# EAGLE design triaki mniejsze_ver.5 (EAGLE 7.6.0)
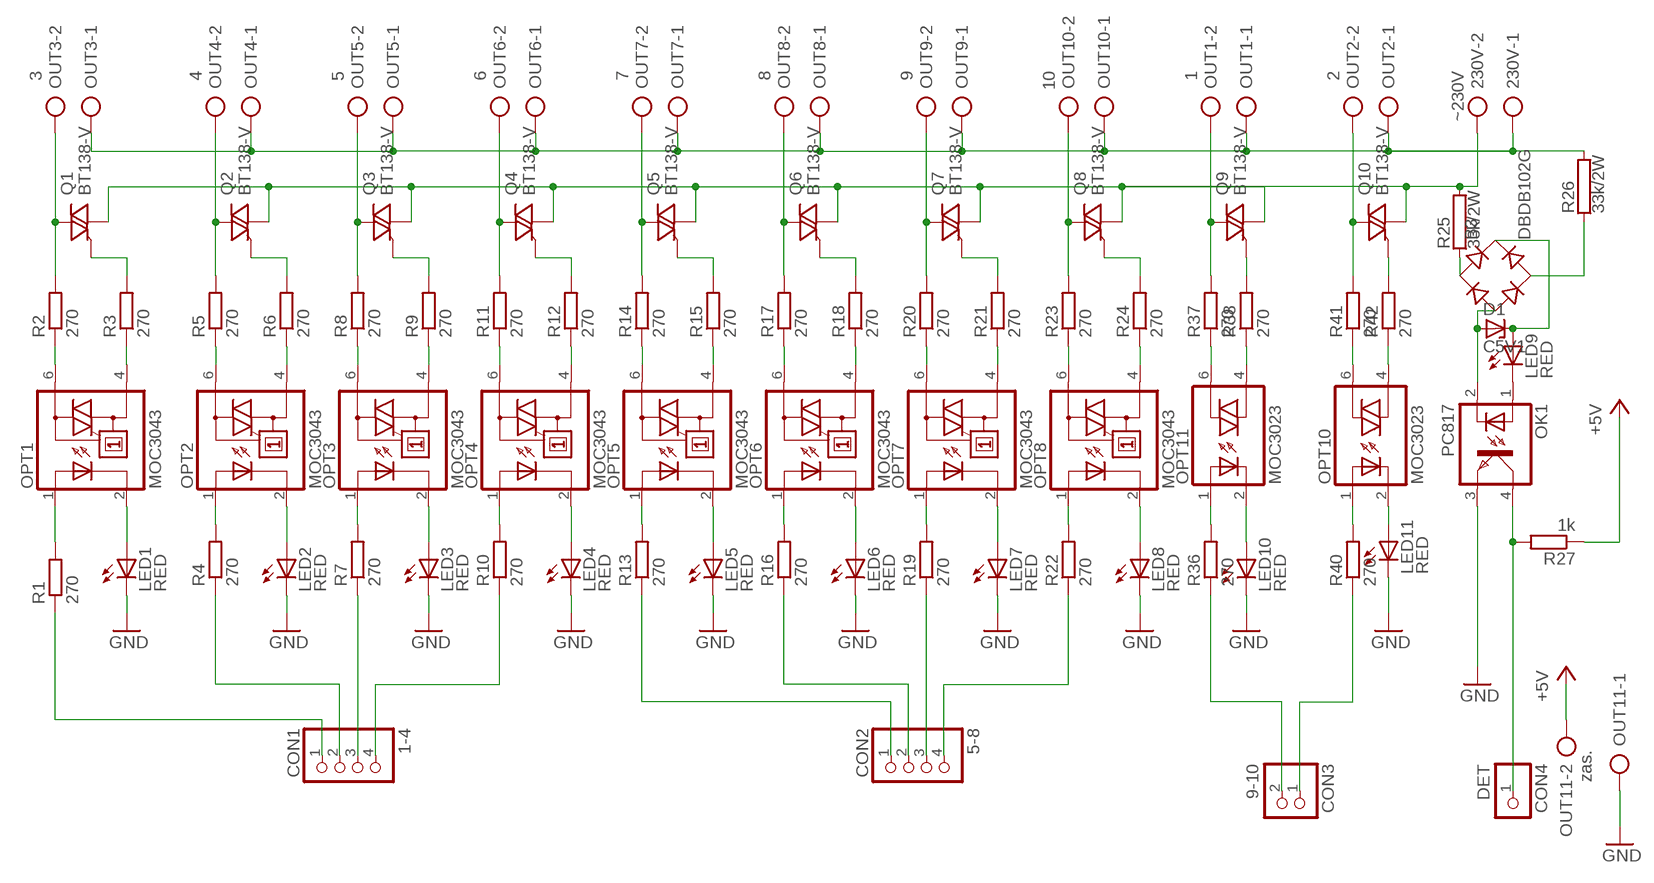
[diagram p0: schematic, sheet 1]

## Parts
230V  ~230V  AK500/2  [AK500/2]
B3  DBDB102G  [DB]
CON1  1-4  PINHD-1X4  [1X04]
CON2  5-8  PINHD-1X4  [1X04]
CON3  9-10  PINHD-1X2  [1X02]
CON4  DET  PINHD-1X1  [1X01]
D1  C5V1  BZX55  [DO35Z10]
LED1  RED  LED3MM  [LED3MM]
LED2  RED  LED3MM  [LED3MM]
LED3  RED  LED3MM  [LED3MM]
LED4  RED  LED3MM  [LED3MM]
LED5  RED  LED3MM  [LED3MM]
LED6  RED  LED3MM  [LED3MM]
LED7  RED  LED3MM  [LED3MM]
LED8  RED  LED3MM  [LED3MM]
LED9  RED  LED3MM  [LED3MM]
LED10  RED  LED3MM  [LED3MM]
LED11  RED  LED3MM  [LED3MM]
OK1  PC817  [DIL04]
OPT1  MOC3043  IL410  [DIL06]
OPT2  MOC3043  IL410  [DIL06]
OPT3  MOC3043  IL410  [DIL06]
OPT4  MOC3043  IL410  [DIL06]
OPT5  MOC3043  IL410  [DIL06]
OPT6  MOC3043  IL410  [DIL06]
OPT7  MOC3043  IL410  [DIL06]
OPT8  MOC3043  IL410  [DIL06]
OPT10  MOC3023  IL420  [DIL06]
OPT11  MOC3023  IL420  [DIL06]
OUT1  1  AK500/2  [AK500/2]
OUT2  2  AK500/2  [AK500/2]
OUT3  3  AK500/2  [AK500/2]
OUT4  4  AK500/2  [AK500/2]
OUT5  5  AK500/2  [AK500/2]
OUT6  6  AK500/2  [AK500/2]
OUT7  7  AK500/2  [AK500/2]
OUT8  8  AK500/2  [AK500/2]
OUT9  9  AK500/2  [AK500/2]
OUT10  10  AK500/2  [AK500/2]
OUT11  zas.  AK500/2  [AK500/2]
Q1  BT138-V  [TO220BV]
Q2  BT138-V  [TO220BV]
Q3  BT138-V  [TO220BV]
Q4  BT138-V  [TO220BV]
Q5  BT138-V  [TO220BV]
Q6  BT138-V  [TO220BV]
Q7  BT138-V  [TO220BV]
Q8  BT138-V  [TO220BV]
Q9  BT138-V  [TO220BV]
Q10  BT138-V  [TO220BV]
R1  270  R-EU_0204/7  [0204/7]
R2  270  R-EU_0204/7  [0204/7]
R3  270  R-EU_0204/7  [0204/7]
R4  270  R-EU_0204/7  [0204/7]
R5  270  R-EU_0204/7  [0204/7]
R6  270  R-EU_0204/7  [0204/7]
R7  270  R-EU_0204/7  [0204/7]
R8  270  R-EU_0204/7  [0204/7]
R9  270  R-EU_0204/7  [0204/7]
R10  270  R-EU_0204/7  [0204/7]
R11  270  R-EU_0204/7  [0204/7]
R12  270  R-EU_0204/7  [0204/7]
R13  270  R-EU_0204/7  [0204/7]
R14  270  R-EU_0204/7  [0204/7]
R15  270  R-EU_0204/7  [0204/7]
R16  270  R-EU_0204/7  [0204/7]
R17  270  R-EU_0204/7  [0204/7]
R18  270  R-EU_0204/7  [0204/7]
R19  270  R-EU_0204/7  [0204/7]
R20  270  R-EU_0204/7  [0204/7]
R21  270  R-EU_0204/7  [0204/7]
R22  270  R-EU_0204/7  [0204/7]
R23  270  R-EU_0204/7  [0204/7]
R24  270  R-EU_0204/7  [0204/7]
R25  33k/2W  RAC01  [AC01]
R26  33k/2W  RAC01  [AC01]
R27  1k  R-EU_0204/7  [0204/7]
R36  270  R-EU_0204/7  [0204/7]
R37  270  R-EU_0204/7  [0204/7]
R38  270  R-EU_0204/7  [0204/7]
R40  270  R-EU_0204/7  [0204/7]
R41  270  R-EU_0204/7  [0204/7]
R42  270  R-EU_0204/7  [0204/7]

## Nets
+5V: OUT11.2 R27.1
GND: LED1.K(C) LED2.K(C) LED3.K(C) LED4.K(C) LED5.K(C) LED6.K(C) LED7.K(C) LED8.K(C) LED10.K(C) LED11.K(C) OK1.3(EMIT) OUT11.1
N$1: R2.1
N$2: OPT1.4(A1) R3.1
N$3: OPT11.1(A) R36.2
N$4: LED1.A OPT1.2(C)
N$5: Q1.G R3.2
N$6: OUT3.2 Q1.T2(A2) R2.2
N$7: OPT10.1(A) R40.2
N$8: OPT2.6(A2) R5.1
N$9: OPT8.1(A) R22.2
N$10: Q2.G R6.2
N$11: OPT2.4(A1) R6.1
N$12: Q9.T1(A1)
N$13: 230V.1 OUT1.1 OUT2.1 OUT3.1 OUT4.1 OUT5.1 OUT6.1 OUT7.1 OUT8.1 OUT9.1 OUT10.1 R26.2
N$14: LED2.A OPT2.2(C)
N$15: OPT7.1(A) R19.2
N$16: OPT6.1(A) R16.2
N$17: OPT3.6(A2) R8.1
N$18: OUT5.2 Q3.T2(A2) R8.2
N$19: Q3.G R9.2
N$20: OPT3.4(A1) R9.1
N$21: LED9.K(C) OK1.1(A)
N$22: OPT5.1(A) R13.2
N$23: LED3.A OPT3.2(C)
N$24: OPT4.1(A) R10.2
N$25: OPT3.1(A) R7.2
N$26: OPT4.6(A2) R11.1
N$27: OUT6.2 Q4.T2(A2) R11.2
N$28: Q4.G R12.2
N$29: OPT4.4(A1) R12.1
N$30: OPT2.1(A) R4.2
N$31: CON1.3 R7.1
N$32: LED4.A OPT4.2(C)
N$33: CON1.4 R10.1
N$34: CON1.2 R4.1
N$35: OPT5.6(A2) R14.1
N$36: OUT7.2 Q5.T2(A2) R14.2
N$37: Q5.G R15.2
N$38: OPT5.4(A1) R15.1
N$39: CON1.1 R1.1
N$40: CON2.3 R19.1
N$41: LED5.A OPT5.2(C)
N$42: B3.+ D1.C LED9.A
N$43: R1.2
N$44: OPT6.6(A2) R17.1
N$45: OUT8.2 Q6.T2(A2) R17.2
N$46: Q6.G R18.2
N$47: OPT6.4(A1) R18.1
N$48: B3.AC1 R25.1
N$49: B3.AC2 R26.1
N$50: LED6.A OPT6.2(C)
N$51: CON2.4 R22.1
N$52: CON2.2 R16.1
N$53: OPT7.6(A2) R20.1
N$54: OUT9.2 Q7.T2(A2) R20.2
N$55: Q7.G R21.2
N$56: OPT7.4(A1) R21.1
N$57: Q9.G R38.2
N$58: B3.- D1.A OK1.2(C)
N$59: LED7.A OPT7.2(C)
N$60: CON2.1 R13.1
N$61: CON3.1 R40.1
N$62: OPT8.6(A2) R23.1
N$63: OUT10.2 Q8.T2(A2) R23.2
N$64: Q8.G R24.2
N$65: OPT8.4(A1) R24.1
N$66: CON3.2 R36.1
N$67: OPT11.4(A1) R38.1
N$68: LED8.A OPT8.2(C)
N$69: OPT10.4(A1) R42.1
N$70: Q10.G R42.2
N$71: LED10.A OPT11.2(C)
N$81: OPT11.6(A2) R37.1
N$82: OUT1.2 Q9.T2(A2) R37.2
N$84: 230V.2 Q1.T1(A1) Q2.T1(A1) Q3.T1(A1) Q4.T1(A1) Q5.T1(A1) Q6.T1(A1) Q7.T1(A1) Q8.T1(A1) Q10.T1(A1) R25.2
N$94: OPT10.6(A2) R41.1
N$96: LED11.A OPT10.2(C)
N$98: OUT2.2 Q10.T2(A2) R41.2
N$99: CON4.1 OK1.4(COL) R27.2
N$106: OUT4.2 Q2.T2(A2) R5.2
Unconnected: OPT1.1(A) OPT1.6(A2)

## Library data of the parts
230V OUT1-OUT11 = con-ptr500:AK500/2: CONNECTOR; OC_FARNELL: unknown; OC_NEWARK: unknown
B3 = rectifier:DB?*G: Single Phase 1.0 AMP Glass Passivated Bridge Rectifier Taiwan Semiconductor Co.,Ltd. - TSC Source: http://www.taiwansemi.com/TSCbig5/ezcatfiles/cust/img/img/db101g.pdf http://www.ts.com.tw/db/pictures/modules/PDT/PDT060207001/DBLS201G.pdf
CON1 CON2 = pinhead:PINHD-1X4: PIN HEADER
CON3 = pinhead:PINHD-1X2: PIN HEADER
CON4 = pinhead:PINHD-1X1: PIN HEADER
D1 = diode:BZX55: Z DIODE
LED1-LED11 = led:LED: LED OSRAM: - CHIPLED LG R971, LG N971, LY N971, LG Q971, LY Q971, LO R971, LY R971 LH N974, LH R974 LS Q976, LO Q976, LY Q976 LO Q996 - Hyper CHIPLED LW Q18S LB Q993, LB Q99A, LB R99A - SideLED LS A670, LO A670, LY A670, LG A670, LP A670 LB A673, LV A673, LT A673, LW A673 LH A674 LY A675 LS A676, LA A676, LO A676, LY A676, LW A676 LS A679, LY A679, LG A679 - Hyper Micro SIDELED® LS Y876, LA Y876, LO Y876, LY Y876 LT Y87S - SmartLED LW L88C, LW L88S LB L89C, LB L89S, LG L890 LS L89K, LO L89K, LY L89K LS L896, LA L896, LO L896, LY L896 - TOPLED LS T670, LO T670, LY T670, LG T670, LP T670 LSG T670, LSP T670, LSY T670, LOP T670, LYG T670 LG T671, LOG T671, LSG T671 LB T673, LV T673, LT T673, LW T673 LH T674 LS T676, LA T676, LO T676, LY T676, LB T676, LH T676, LSB T676, LW T676 LB T67C, LV T67C, LT T67C, LS T67K, LO T67K, LY T67K, LW E67C LS E67B, LA E67B, LO E67B, LY E67B, LB E67C, LV E67C, LT E67C LW T67C LS T679, LY T679, LG T679 LS T770, LO T770, LY T770, LG T770, LP T770 LB T773, LV T773, LT T773, LW T773 LH T774 LS E675, LA E675, LY E675, LS T675 LS T776, LA T776, LO T776, LY T776, LB T776 LHGB T686 LT T68C, LB T68C - Hyper Mini TOPLED® LB M676 - Mini TOPLED Santana® LG M470 LS M47K, LO M47K, LY M47K Source: http://www.osram.convergy.de LUXEON: - LUMILED® LXK2-PW12-R00, LXK2-PW12-S00, LXK2-PW14-U00, LXK2-PW14-V00 LXK2-PM12-R00, LXK2-PM12-S00, LXK2-PM14-U00 LXK2-PE12-Q00, LXK2-PE12-R00, LXK2-PE12-S00, LXK2-PE14-T00, LXK2-PE14-U00 LXK2-PB12-K00, LXK2-PB12-L00, LXK2-PB12-M00, LXK2-PB14-N00, LXK2-PB14-P00, LXK2-PB14-Q00 LXK2-PR12-L00, LXK2-PR12-M00, LXK2-PR14-Q00, LXK2-PR14-R00 LXK2-PD12-Q00, LXK2-PD12-R00, LXK2-PD12-S00 LXK2-PH12-R00, LXK2-PH12-S00 LXK2-PL12-P00, LXK2-PL12-Q00, LXK2-PL12-R00 Source: www.luxeon.com KINGBRIGHT: KA-3528ASYC Source: www.kingbright.com
OK1 = optocoupler:PC817: SHARP OPTO COUPLER; MPN: PC817X4J000F; OC_FARNELL: 9707727; OC_NEWARK: 97K7059
OPT1-OPT8 = optocoupler:IL410: SIEMENS OPTO COUPLER; MF: FAIRCHILD SEMICONDUCTOR; MPN: MOC3041; OC_FARNELL: 1045434; OC_NEWARK: 58K1715
OPT10 OPT11 = optocoupler:IL420: SIEMENS OPTO COUPLER; MF: FAIRCHILD SEMICONDUCTOR; MPN: MOC3021; OC_FARNELL: 1469561; OC_NEWARK: 58K1719
Q1-Q10 = triac:BT138: TRIAC Source: http://www.semiconductors.philips.com BT138_SERIES_2.pdf
R1-R24 R27 R36-R38 R40-R42 = rcl:R-EU_: RESISTOR, European symbol
R25 R26 = resistor-power:R: Power Resitor; OC_FARNELL: unknown; OC_NEWARK: unknown

## Board
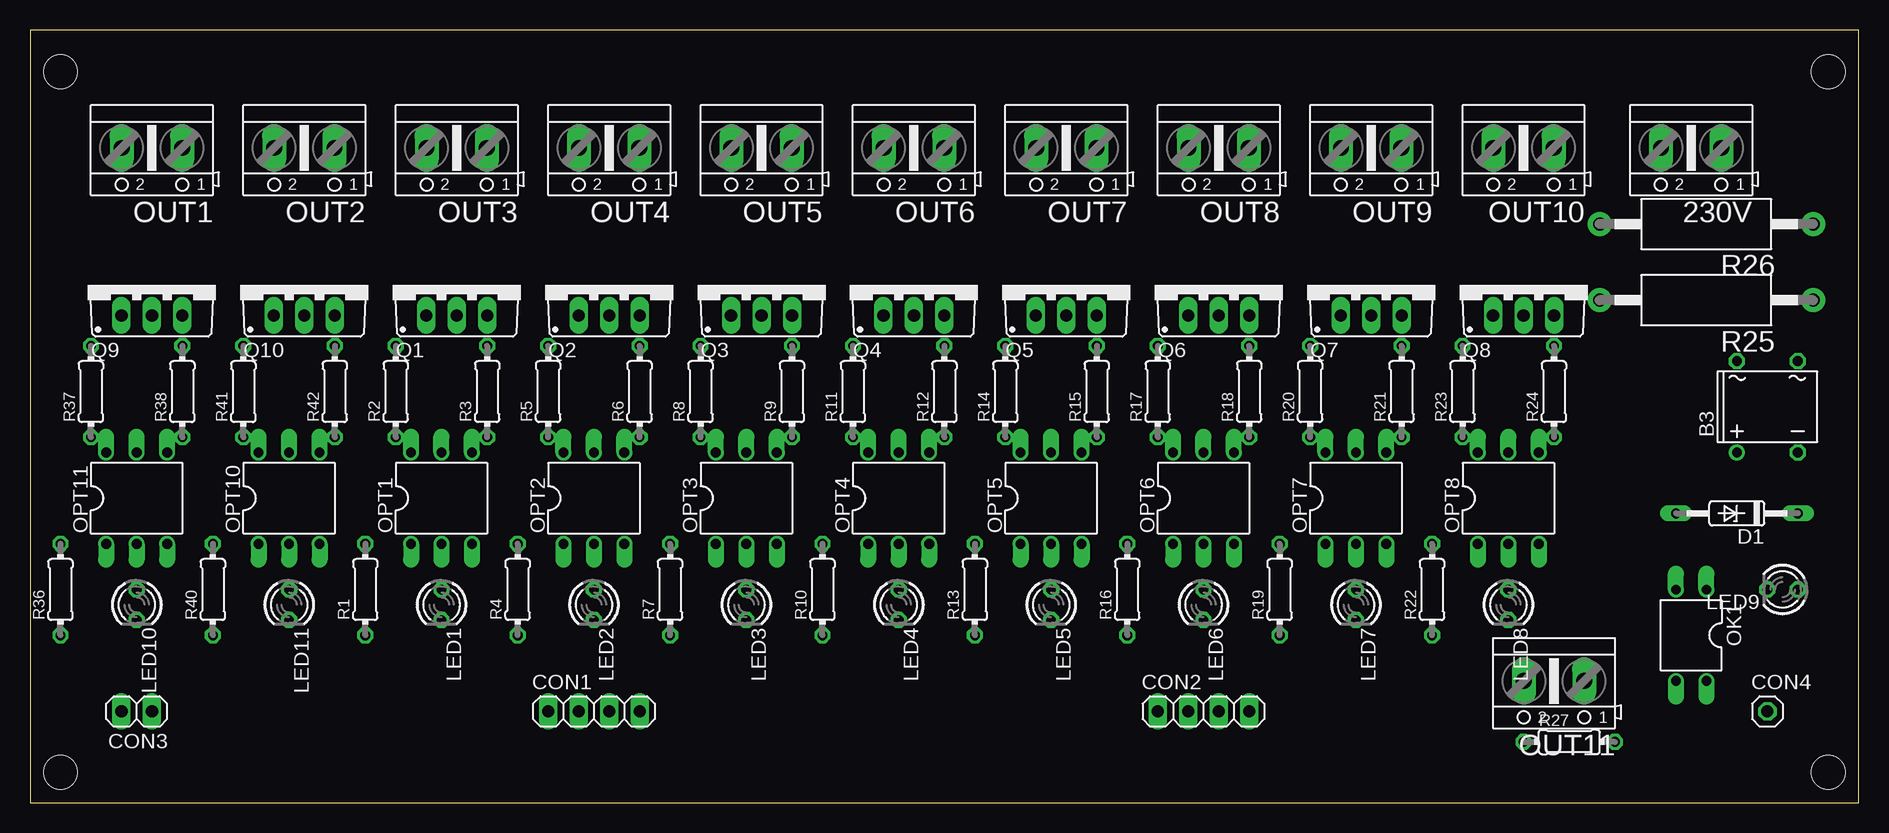
[diagram p1: board, top side]
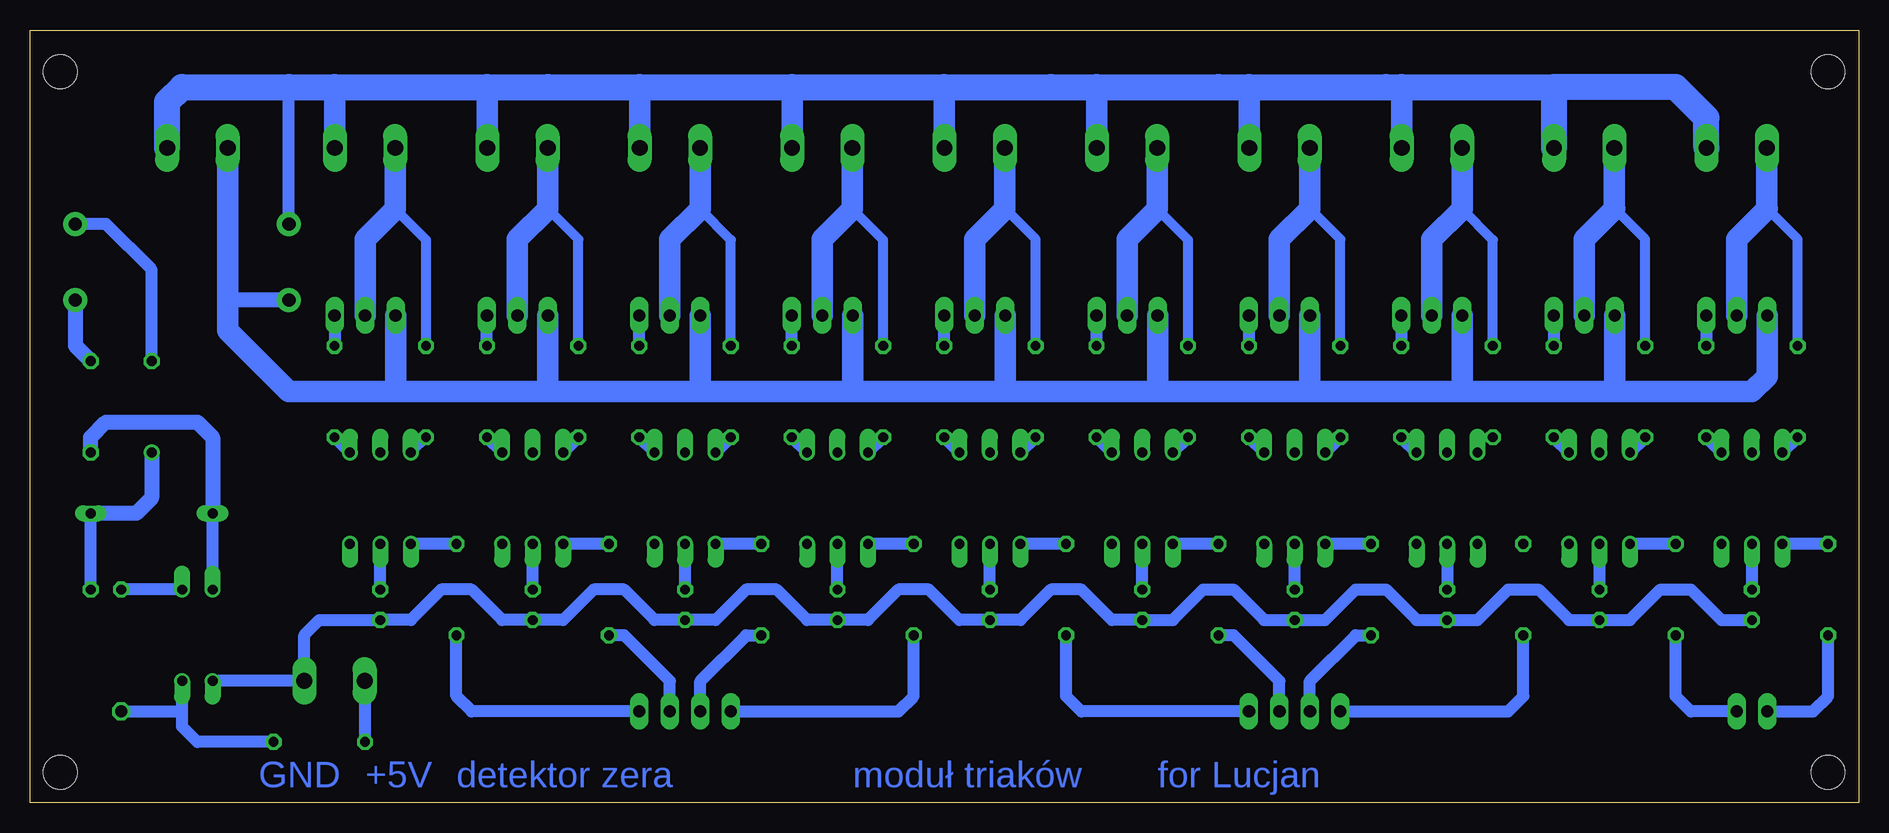
[diagram p2: board, bottom side, seen from below]

Size 152.38 x 64.44 mm. Coordinates in mm from the lower left corner, seen from the top.
Outline: 0,0 152.38,0 152.38,64.44 0,64.44 0,0
Copper layers (1*16): Top 0.035mm / dielectric 1.5mm / Bottom 0.035mm
Design rules "default": minimum track width 10mil, minimum drill 24mil, track to track 8mil, track to pad 8mil, pad to pad 8mil, via to via 8mil, smd to smd 8mil, copper to edge 40mil, drill to drill 8mil, minimum pad ring 10mil, minimum via ring 8mil, stop-mask expansion 4mil, vias tented up to drill 0mil, thermal gap 10mil
Holes 2.8 mm at 149.86,2.54 2.54,2.54 2.54,60.96 149.86,60.96

### Footprints (pad centres in the part's own frame; a part is rotated, then mirrored left to right if it is on the bottom)
AK500/2 = drill 1.321 long: 1 -2.515,0; 2 2.515,0
DB = drill 0.813: + -2.54,-3.81 | drill 0.813 octagon: - 2.54,-3.81; AC1 2.54,3.81; AC2 -2.54,3.81
1X04 = drill 1.016 long: 1 -3.81,0; 2 -1.27,0; 3 1.27,0; 4 3.81,0
1X02 = drill 1.016 long: 1 -1.27,0; 2 1.27,0
1X01 = drill 1.016 octagon: 1 0,0
DO35Z10 = drill 0.813 long: A 5.08,0; C -5.08,0
LED3MM = drill 0.813 octagon: A -1.27,0; K 1.27,0
DIL04 = drill 0.813 offset: 1 -1.27,-3.81; 2 1.27,-3.81; 3 1.27,3.81; 4 -1.27,3.81
DIL06 = drill 0.813 offset: 1 -2.54,-3.81; 2 0,-3.81; 3 2.54,-3.81; 4 2.54,3.81; 5 0,3.81; 6 -2.54,3.81
TO220BV = drill 1.016 long: G 2.54,-2.54; T1 -2.54,-2.54; T2 0,-2.54
0204/7 = drill 0.813 octagon: 1 -3.81,0; 2 3.81,0
AC01 = drill 1.1 pad 2: 1 -8.9,0; 2 8.9,0

### Placement (x,y rotation side)
230V  138.43,54.61 180 top
B3  144.78,33.02 0 top
CON1  46.99,7.62 0 top
CON2  97.79,7.62 0 top
CON3  8.89,7.62 180 top
CON4  144.78,7.62 0 top
D1  142.24,24.13 180 top
LED1  34.29,16.51 270 top
LED2  46.99,16.51 270 top
LED3  59.69,16.51 270 top
LED4  72.39,16.51 270 top
LED5  85.09,16.51 270 top
LED6  97.79,16.51 270 top
LED7  110.49,16.51 270 top
LED8  123.19,16.51 270 top
LED9  146.05,17.78 180 top
LED10  8.89,16.51 270 top
LED11  21.59,16.51 270 top
OK1  138.43,13.97 180 top
OPT1  34.29,25.4 0 top
OPT2  46.99,25.4 0 top
OPT3  59.69,25.4 0 top
OPT4  72.39,25.4 0 top
OPT5  85.09,25.4 0 top
OPT6  97.79,25.4 0 top
OPT7  110.49,25.4 0 top
OPT8  123.19,25.4 0 top
OPT10  21.59,25.4 0 top
OPT11  8.89,25.4 0 top
OUT1  10.16,54.61 180 top
OUT2  22.86,54.61 180 top
OUT3  35.56,54.61 180 top
OUT4  48.26,54.61 180 top
OUT5  60.96,54.61 180 top
OUT6  73.66,54.61 180 top
OUT7  86.36,54.61 180 top
OUT8  99.06,54.61 180 top
OUT9  111.76,54.61 180 top
OUT10  124.46,54.61 180 top
OUT11  127,10.16 180 top
Q1  35.56,43.18 0 top
Q2  48.26,43.18 0 top
Q3  60.96,43.18 0 top
Q4  73.66,43.18 0 top
Q5  86.36,43.18 0 top
Q6  99.06,43.18 0 top
Q7  111.76,43.18 0 top
Q8  124.46,43.18 0 top
Q9  10.16,43.18 0 top
Q10  22.86,43.18 0 top
R1  27.94,17.78 90 top
R2  30.48,34.29 90 top
R3  38.1,34.29 90 top
R4  40.64,17.78 90 top
R5  43.18,34.29 90 top
R6  50.8,34.29 90 top
R7  53.34,17.78 90 top
R8  55.88,34.29 90 top
R9  63.5,34.29 90 top
R10  66.04,17.78 90 top
R11  68.58,34.29 90 top
R12  76.2,34.29 90 top
R13  78.74,17.78 90 top
R14  81.28,34.29 90 top
R15  88.9,34.29 90 top
R16  91.44,17.78 90 top
R17  93.98,34.29 90 top
R18  101.6,34.29 90 top
R19  104.14,17.78 90 top
R20  106.68,34.29 90 top
R21  114.3,34.29 90 top
R22  116.84,17.78 90 top
R23  119.38,34.29 90 top
R24  127,34.29 90 top
R25  139.7,41.91 180 top
R26  139.7,48.26 180 top
R27  128.27,5.08 0 top
R36  2.54,17.78 90 top
R37  5.08,34.29 90 top
R38  12.7,34.29 90 top
R40  15.24,17.78 90 top
R41  17.78,34.29 90 top
R42  25.4,34.29 90 top

### Tracks (layer width: path | path; a pad name or v marks a point on that pad's centre or on a via)
+5V
  Bottom 1.016: OUT11.2 124.48,5.1 R27.1
GND
  Bottom 1.016: OK1.3 OUT11.1 129.51,13.99 128.27,15.24 LED8.K 120.65,15.24 118.11,17.78 115.57,17.78 113.03,15.24 LED7.K 107.95,15.24 105.41,17.78 102.87,17.78 100.33,15.24 LED6.K 95.25,15.24 92.71,17.78 90.17,17.78 87.63,15.24 LED5.K 82.55,15.24 80.01,17.78 77.47,17.78 74.93,15.24 LED4.K 69.85,15.24 67.31,17.78 64.77,17.78 62.23,15.24 LED3.K 57.15,15.24 54.61,17.78 52.07,17.78 49.53,15.24 LED2.K 44.45,15.24 41.91,17.78 39.37,17.78 36.83,15.24 LED1.K 31.75,15.24 29.21,17.78 26.67,17.78 24.13,15.24 LED11.K 19.05,15.24 16.51,17.78 13.97,17.78 11.43,15.24 LED10.K
N$2
  Bottom 1.016: R3.1 OPT1.4
N$3
  Bottom 1.016: R36.2 OPT11.1
N$4
  Bottom 1.016: OPT1.2 LED1.A
N$5
  Bottom 1.016: Q1.G R3.2
N$6
  Bottom 0.813: R2.2 30.48,46.94 33.05,49.51
  Bottom 1.778: OUT3.2 33.05,49.51 35.56,46.99 Q1.T2
N$7
  Bottom 1.016: R40.2 OPT10.1
N$8
  Bottom 1.016: R5.1 OPT2.6
N$9
  Bottom 1.016: R22.2 OPT8.1
N$10
  Bottom 1.016: Q2.G R6.2
N$11
  Bottom 1.016: OPT2.4 R6.1
N$13
  Bottom 1.016: R26.2 130.8,59.68 130.81,59.69
  Bottom 1.778: OUT3.1 38.08,59.66 38.1,59.69 | OUT4.1 50.77,59.66 50.8,59.69 | OUT5.1 63.48,59.66 63.5,59.69 | OUT6.1 76.17,59.66 76.2,59.69 | OUT7.1 88.88,59.66 88.9,59.69 | OUT8.1 101.57,59.66 101.6,59.69 | OUT9.1 114.28,59.66 114.3,59.69 | OUT10.1 126.97,59.66 127,59.69
  Bottom 2.184: 53.34,59.69 50.8,59.69 39.37,59.69 | 39.37,59.69 38.1,59.69 25.4,59.69 | 67.31,59.69 63.5,59.69 53.34,59.69 | 109.22,59.69 101.6,59.69 88.9,59.69 76.2,59.69 67.31,59.69 | 109.22,59.69 114.3,59.69 127,59.69 130.81,59.69 139.7,59.69 140.94,58.45 230V.1 | 53.31,59.66 53.34,59.69 | 67.28,59.66 67.31,59.69 | 109.19,59.66 109.22,59.69 | 39.34,59.66 39.37,59.69 | OUT2.1 25.38,59.66 25.4,59.69 | OUT1.1 12.67,57.12 15.24,59.69 25.4,59.69
N$14
  Bottom 1.016: LED2.A OPT2.2
N$15
  Bottom 1.016: R19.2 OPT7.1
N$16
  Bottom 1.016: R16.2 OPT6.1
N$17
  Bottom 1.016: R8.1 OPT3.6
N$18
  Bottom 0.813: R8.2 55.88,46.94 58.45,49.51
  Bottom 1.778: OUT5.2 58.45,49.51 60.96,46.99 Q3.T2
N$19
  Bottom 1.016: R9.2 Q3.G
N$20
  Bottom 1.016: OPT3.4 R9.1
N$21
  Bottom 1.016: OK1.1 LED9.K
N$22
  Bottom 1.016: R13.2 OPT5.1
N$23
  Bottom 1.016: LED3.A OPT3.2
N$24
  Bottom 1.016: R10.2 OPT4.1
N$25
  Bottom 1.016: R7.2 OPT3.1
N$26
  Bottom 1.016: R11.1 OPT4.6
N$27
  Bottom 0.813: R11.2 68.58,46.99 71.12,49.53 71.14,49.51
  Bottom 1.778: OUT6.2 71.14,49.51 73.66,46.99 Q4.T2
N$28
  Bottom 1.016: R12.2 Q4.G
N$29
  Bottom 1.016: OPT4.4 R12.1
N$30
  Bottom 1.016: R4.2 OPT2.1
N$31
  Bottom 1.016: CON1.3 48.26,10.16 52.07,13.97 R7.1
N$32
  Bottom 1.016: LED4.A OPT4.2
N$33
  Bottom 1.016: CON1.4 64.77,7.62 66.04,8.89 R10.1
N$34
  Bottom 1.016: CON1.2 45.72,10.16 41.91,13.97 R4.1
N$35
  Bottom 1.016: R14.1 OPT5.6
N$36
  Bottom 0.813: R14.2 81.28,46.94 83.84,49.51
  Bottom 1.778: OUT7.2 83.84,49.51 86.36,46.99 Q5.T2
N$37
  Bottom 1.016: R15.2 Q5.G
N$38
  Bottom 1.016: OPT5.4 R15.1
N$39
  Bottom 1.016: CON1.1 29.21,7.62 27.94,8.89 R1.1
N$40
  Bottom 1.016: CON2.3 99.06,10.16 102.87,13.97 R19.1
N$41
  Bottom 1.016: LED5.A OPT5.2
N$42
  Bottom 1.016: LED9.A D1.C
  Bottom 1.27: B3.+ 142.24,25.4 143.51,24.13 D1.C
N$44
  Bottom 1.016: R17.1 OPT6.6
N$45
  Bottom 0.813: R17.2 93.98,46.94 96.54,49.51
  Bottom 1.778: OUT8.2 96.54,49.51 99.06,46.99 Q6.T2
N$46
  Bottom 1.016: R18.2 Q6.G
N$47
  Bottom 1.016: OPT6.4 R18.1
N$48
  Bottom 1.27: R25.1 148.6,38.11 B3.AC1
N$49
  Bottom 1.016: B3.AC2 142.24,44.45 146.05,48.26 R26.1
N$50
  Bottom 1.016: LED6.A OPT6.2
N$51
  Bottom 1.016: CON2.4 115.57,7.62 116.84,8.89 R22.1
N$52
  Bottom 1.016: CON2.2 96.52,10.16 92.71,13.97 R16.1
N$53
  Bottom 1.016: R20.1 OPT7.6
N$54
  Bottom 0.813: R20.2 106.68,46.99 109.22,49.53 109.25,49.51
  Bottom 1.778: OUT9.2 109.25,49.51 111.76,46.99 Q7.T2
N$55
  Bottom 1.016: R21.2 Q7.G
N$56
  Bottom 1.016: OPT7.4 R21.1
N$57
  Bottom 1.016: Q9.G R38.2
N$58
  Bottom 1.016: 137.38,24.35 D1.A OK1.2
  Bottom 1.27: B3.- 147.32,30.48 146.05,31.75 138.43,31.75 137.16,30.48 D1.A
N$59
  Bottom 1.016: LED7.A OPT7.2
N$60
  Bottom 1.016: CON2.1 80.01,7.62 78.74,8.89 R13.1
N$61
  Bottom 1.016: CON3.1 13.97,7.62 15.24,8.89 R40.1
N$62
  Bottom 0.813: R23.1 OPT8.6
N$63
  Bottom 0.813: R23.2 119.38,46.94 121.94,49.51
  Bottom 1.778: OUT10.2 121.94,49.51 124.46,46.99 Q8.T2
N$64
  Bottom 1.016: Q8.G R24.2
N$65
  Bottom 1.016: OPT8.4 R24.1
N$66
  Bottom 1.016: CON3.2 3.81,7.62 2.54,8.89 R36.1
N$67
  Bottom 1.016: R38.1 OPT11.4
N$68
  Bottom 1.016: LED8.A OPT8.2
N$69
  Bottom 1.016: R42.1 OPT10.4
N$70
  Bottom 1.016: Q10.G R42.2
N$71
  Bottom 1.016: OPT11.2 LED10.A
N$81
  Bottom 1.016: R37.1 OPT11.6
N$82
  Bottom 0.813: R37.2 5.08,46.99 7.62,49.53
  Bottom 1.778: OUT1.2 7.64,49.55 7.62,49.53 10.16,46.99 Q9.T2
N$84
  Bottom 1.27: R25.2 135.91,41.91
  Bottom 1.778: 121.92,34.29 109.22,34.29 | 109.22,34.29 96.52,34.29 | 96.52,34.29 83.82,34.29 | 83.82,34.29 71.12,34.29 | 71.12,34.29 58.42,34.29 | 58.42,34.29 45.72,34.29 | 45.72,34.29 33.02,34.29 | Q1.T1 33.02,34.29 | Q2.T1 45.72,34.29 | Q3.T1 58.42,34.29 | Q4.T1 71.12,34.29 | Q5.T1 83.82,34.29 | Q6.T1 96.52,34.29 | Q7.T1 109.22,34.29 | Q8.T1 121.92,34.29 | 121.92,34.29 130.81,34.29 135.91,39.4 135.91,41.91 230V.2 | 33.02,34.29 20.32,34.29 | 20.32,34.29 8.89,34.29 7.62,35.56 7.62,40.64 | Q10.T1 20.32,34.29
N$94
  Bottom 1.016: OPT10.6 R41.1
N$96
  Bottom 1.016: OPT10.2 LED11.A
N$98
  Bottom 0.813: R41.2 17.78,46.99 20.32,49.53
  Bottom 1.778: OUT2.2 20.34,49.55 20.32,49.53 22.86,46.99 Q10.T2
N$99
  Bottom 1.016: R27.2 138.43,5.08 139.7,6.35 139.7,7.62 | 139.7,7.62 OK1.4 | CON4.1 139.7,7.62
N$106
  Bottom 0.813: R5.2 43.18,46.99 45.72,49.53 45.74,49.51
  Bottom 1.778: OUT4.2 45.74,49.51 48.26,46.99 Q2.T2

### Text on the board
Bottom: for Lucjan | moduł triaków | detektor zera | +5V | GND